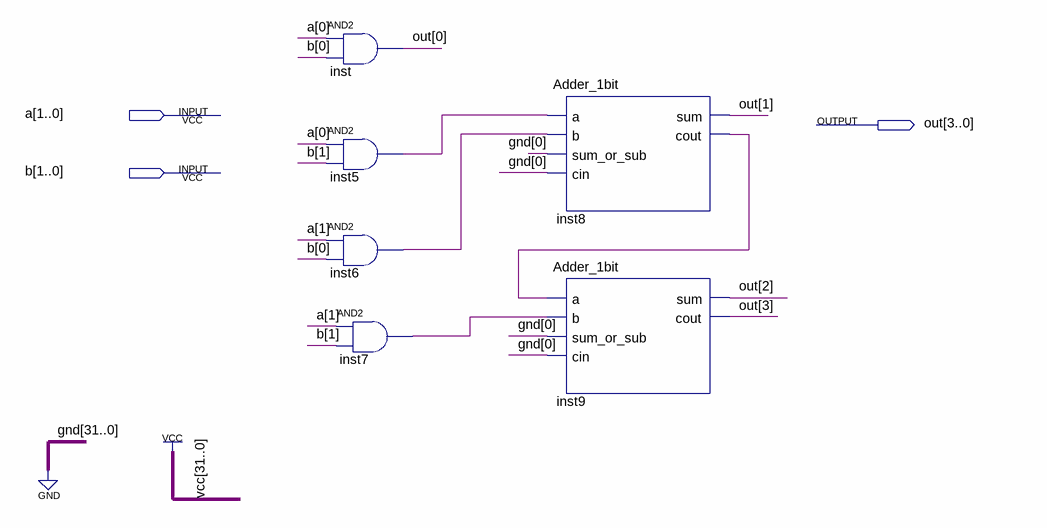
[diagram p0: schematic sheet]
// Quartus schematic Multiplier_2bit.bdf as structural Verilog: 6 symbols, 3 pins
module Multiplier_2bit (
  input  [1:0] a,
  input  [1:0] b,
  output [3:0] out
);

  wire inst5_out, inst6_out, inst7_out, inst8_cout;

  and inst (out[0], a[0], b[0]);
  and inst5 (inst5_out, a[0], b[1]);
  and inst6 (inst6_out, a[1], b[0]);
  and inst7 (inst7_out, a[1], b[1]);
  Adder_1bit inst8 (.a(inst5_out), .b(inst6_out), .sum_or_sub(1'b0), .cin(1'b0), .sum(out[1]), .cout(inst8_cout));
  Adder_1bit inst9 (.a(inst8_cout), .b(inst7_out), .sum_or_sub(1'b0), .cin(1'b0), .sum(out[2]), .cout(out[3]));
endmodule
